# Altium project Super_Hornet_1.0.PrjPcb (part 3 of 5)
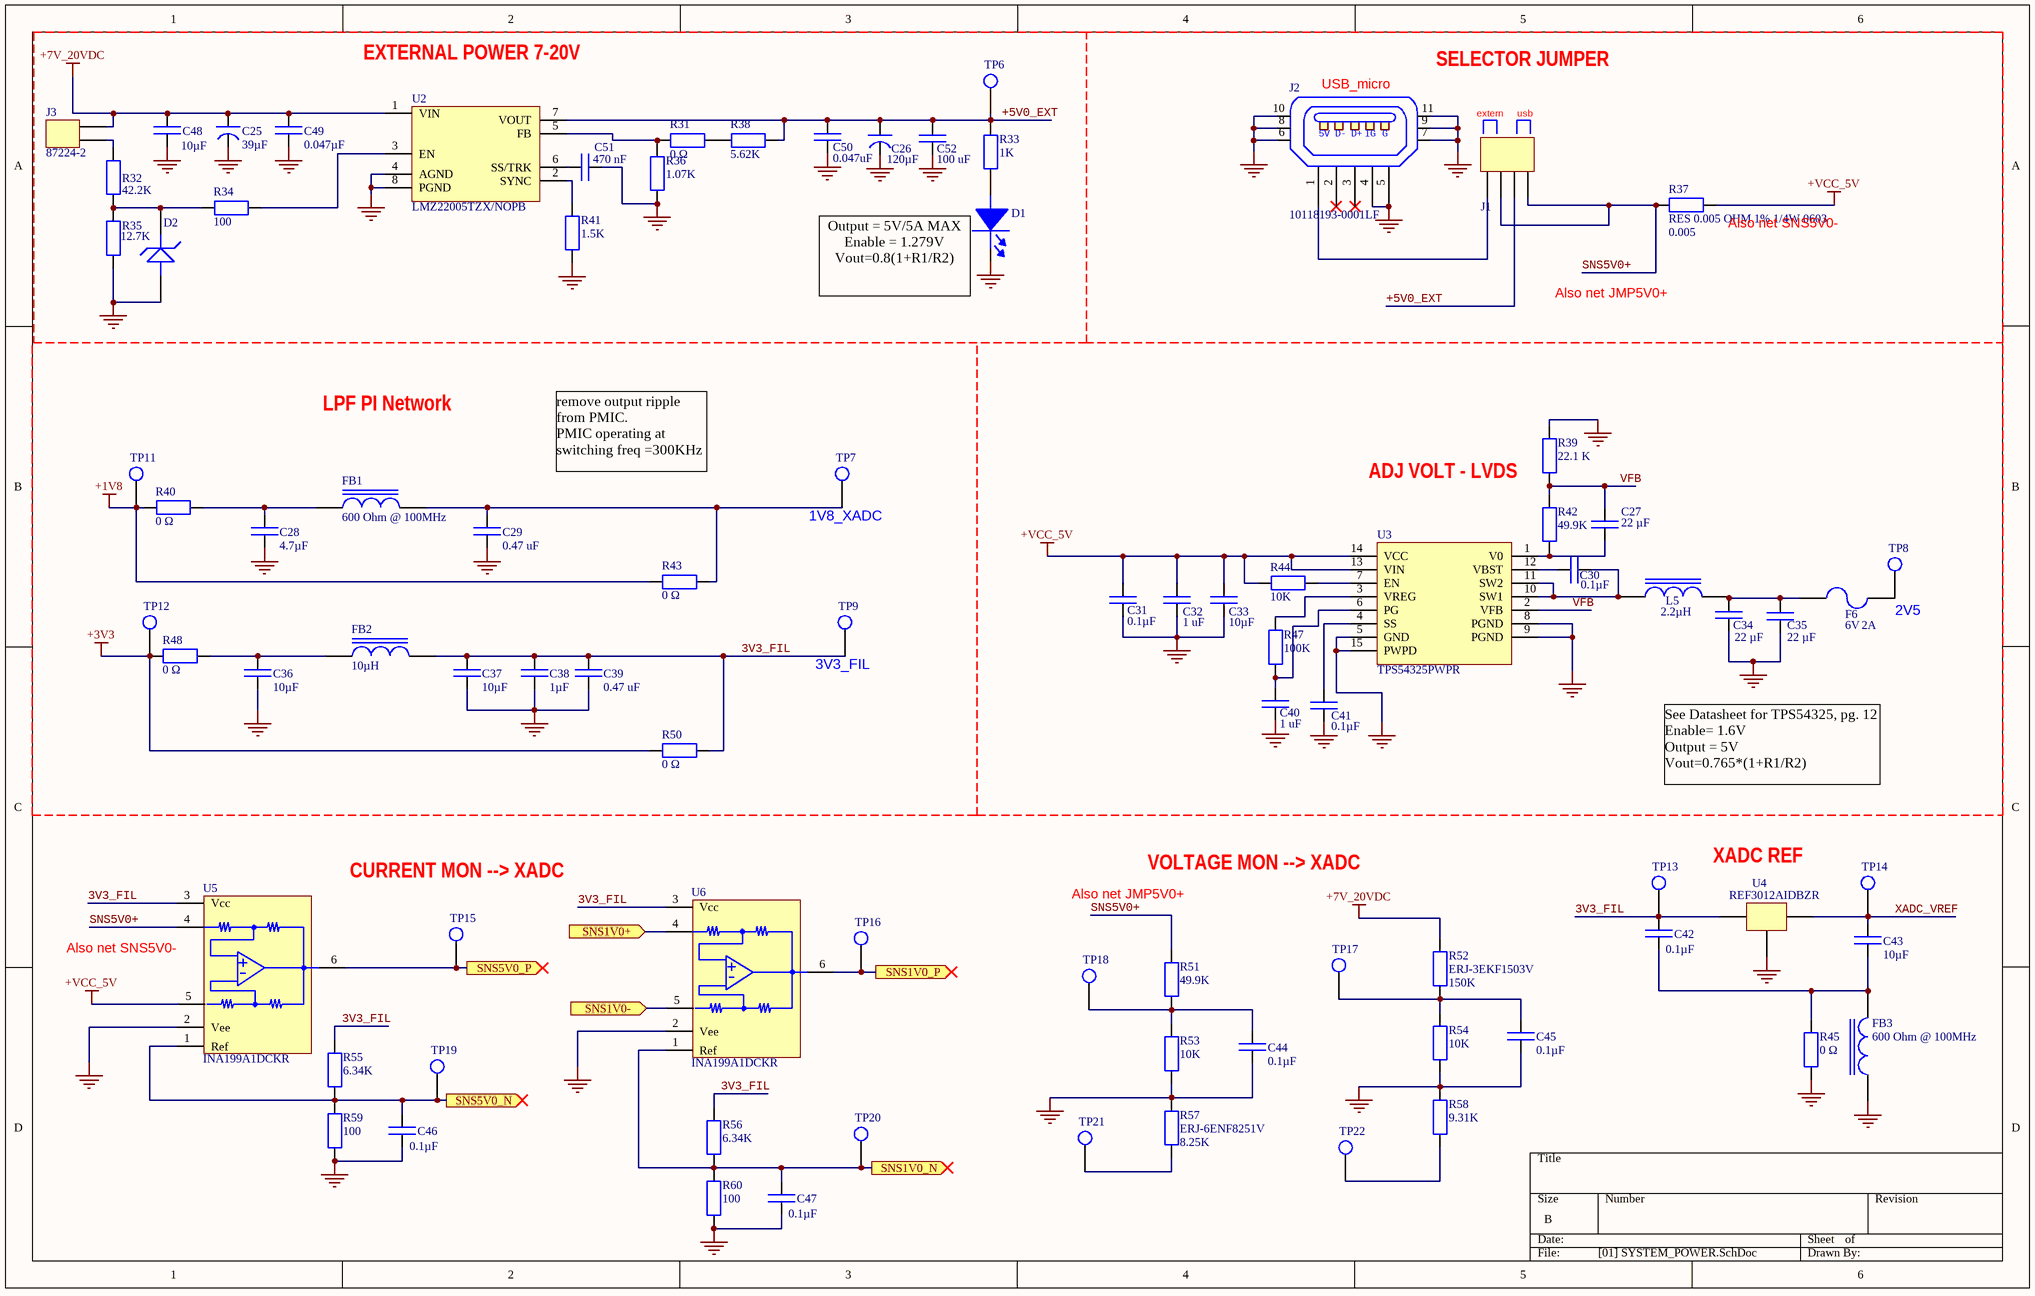
[diagram p4: [01] SYSTEM_POWER.SchDoc]

## Sheet [01] SYSTEM_POWER.SchDoc (continued)

### Library data of the parts (continued)
R35 = ERJ-3EKF1272V: RES SMD 12.7K OHM 1% 1/10W 0603; Manufacturer: Panasonic; Rated Power: 0.1 W; Temp Coefficient: ±100 ppm/°C; Supplier 1: Digi-Key; Manufacturer Part Number: ERJ-3EKF1272V; Stock 1: 278983; Pricing 1: 1=0.1, 10=0.032, 100=0.013, 1000=0.0058, 2500=0.0051 (USD); Size Code: 0603; Tolerance (%): ±1 %; ComponentLink1URL: http://www.farnell.com/datasheets/1678782.pdf?src-supplier=Element14; ComponentLink1Description: http://www.farnell.com/datasheets/1678782.pdf?src-supplier=Element14; ComponentLink2URL: http://www.farnell.com/datasheets/426256.pdf?src-supplier=Element14; ComponentLink2Description: http://www.farnell.com/datasheets/426256.pdf?src-supplier=Element14; ComponentLink3URL: http://www.alliedelec.com/m/d/623f45ff1957d936ff56d46fd1c28cac.pdf?src-supplier=Allied+Electronics; ComponentLink3Description: http://www.alliedelec.com/m/d/623f45ff1957d936ff56d46fd1c28cac.pdf?src-supplier=Allied+Electronics; ComponentLink4URL: http://industrial.panasonic.com/www-data/pdf/AOA0000/AOA0000CE2.pdf?src-supplier=Avnet; ComponentLink4Description: http://industrial.panasonic.com/www-data/pdf/AOA0000/AOA0000CE2.pdf?src-supplier=Avnet; Supplier Part Number 1: P12.7KHCT-ND
R36 = ERJ-6ENF1071V: RES SMD 1.07K OHM 1% 1/8W 0805; Manufacturer: Panasonic; EDA / CAD Models: Download from Accelerated Designs; Power (Watts): 0.125W, 1/8W; Temperature Coefficient: ±100ppm/°C; Online Catalog: ERJ Series; Kits: RSM3CA-ND  - RES KIT 1K-9.76K 1/8W 4800PCS RSM3C-ND  - RES KIT 1K-9.76K 1/8W 19200PCS; Other Names: ERJ-6ENF1071 ERJ6ENF1071 P1.07KCBK P1.07KCCT; Supplier 1: Digi-Key; Manufacturer Part Number: ERJ-6ENF1071V; Stock 1: 40812; Pricing 1: 1=0.1, 10=0.072, 100=0.0275, 1000=0.0121, 2500=0.0105 (USD); Standard Package: 1; Category: Resistors; Family: Chip Resistor - Surface Mount; Series: ERJ; Packaging: Cut Tape (CT); Tolerance: ±1%; Composition: Thick Film; Features: Automotive AEC-Q200; Operating Temperature: -55°C ~ 155°C; Package / Case: 0805 (2012 Metric); Supplier Device Package: 0805; Size / Dimension: 0.079" L x 0.049" W (2.00mm x 1.25mm); Height: 0.028" (0.70mm); Number of Terminations: 2; ComponentLink1URL: http://industrial.panasonic.com/www-data/pdf/AOA0000/AOA0000CE2.pdf?src-supplier=Avnet; ComponentLink1Description: http://industrial.panasonic.com/www-data/pdf/AOA0000/AOA0000CE2.pdf?src-supplier=Avnet; ComponentLink2URL: http://www.mouser.com/ds/2/315/AOA0000C283-1093288.pdf?src-supplier=Mouser; ComponentLink2Description: http://www.mouser.com/ds/2/315/AOA0000C283-1093288.pdf?src-supplier=Mouser; Supplier Part Number 1: P1.07KCCT-ND
R37 = ERJ-3LWFR005V: Manufacturer: Panasonic; Power (Watts): 0.25W, 1/4W; Temperature Coefficient: 0/ +700ppm/°C; Supplier 1: Digi-Key; Manufacturer Part Number: ERJ-3LWFR005V; Stock 1: 76322; Pricing 1: 1=0.51, 10=0.39, 25=0.2964, 50=0.2202, 100=0.1638, 250=0.1384, 500=0.1186, 1000=0.0904 (USD); Category: Resistors; Family: Chip Resistor - Surface Mount; Series: ERJ; Packaging: Tape & Reel (TR); Tolerance: ±1%; Composition: Thick Film; Features: Automotive AEC-Q200, Current Sense; Operating Temperature: -55°C ~ 125°C; Package / Case: 0603 (1608 Metric); Supplier Device Package: 0603; Size / Dimension: 0.063" L x 0.031" W (1.60mm x 0.80mm); Height: 0.026" (0.65mm); Number of Terminations: 2; ComponentLink1URL: http://www.mouser.com/ds/2/315/AOA0000C295-1109214.pdf?src-supplier=Mouser; ComponentLink1Description: http://www.mouser.com/ds/2/315/AOA0000C295-1109214.pdf?src-supplier=Mouser; ComponentLink2URL: https://industrial.panasonic.com/cdbs/www-data/pdf/RDN0000/AOA0000C313.pdf?src-supplier=Digi-Key; ComponentLink2Description: https://industrial.panasonic.com/cdbs/www-data/pdf/RDN0000/AOA0000C313.pdf?src-supplier=Digi-Key; ComponentLink3URL: http://www.farnell.com/datasheets/2631545.pdf?src-supplier=Farnell; ComponentLink3Description: http://www.farnell.com/datasheets/2631545.pdf?src-supplier=Farnell; ComponentLink4URL: http://www.farnell.com/datasheets/2631545.pdf?src-supplier=Newark; ComponentLink4Description: http://www.farnell.com/datasheets/2631545.pdf?src-supplier=Newark; Supplier Part Number 1: P19182CT-ND
R38 = ERJ-6ENF5621V: RES SMD 5.62K OHM 1% 1/8W 0805; Manufacturer: Panasonic; Resistor Element Type: Thick Film; Product Range: PANASONIC - ERJ Series; Power Rating: 125mW; Resistor Case Style: 0805 [2012 Metric]; Temperature Coefficient: ± 100ppm/°C; Voltage Rating: 150V; SVHC: Diboron trioxide (19-Dec-2012); SVHC (Secondary): Lead monoxide (lead oxide) (19-Dec-2012); Supplier 1: Digi-Key; Manufacturer Part Number: ERJ-6ENF5621V; Stock 1: 24844; Pricing 1: 1=0.1, 10=0.072, 100=0.0275, 1000=0.0121, 2500=0.0105 (USD); Resistance Tolerance: ± 1%; Resistor Element Material: Thick Film; Packaging: Cut Tape; MSL: (Not Applicable); Resistor Mounting: SMD; ComponentLink1URL: http://industrial.panasonic.com/www-data/pdf/AOA0000/AOA0000CE2.pdf?src-supplier=Avnet; ComponentLink1Description: http://industrial.panasonic.com/www-data/pdf/AOA0000/AOA0000CE2.pdf?src-supplier=Avnet; ComponentLink2URL: http://www.farnell.com/datasheets/426256.pdf?src-supplier=Element14; ComponentLink2Description: http://www.farnell.com/datasheets/426256.pdf?src-supplier=Element14; ComponentLink3URL: http://www.farnell.com/datasheets/1911175.pdf?src-supplier=Farnell; ComponentLink3Description: http://www.farnell.com/datasheets/1911175.pdf?src-supplier=Farnell; ComponentLink4URL: http://industrial.panasonic.com/www-data/pdf/AOA0000/AOA0000CE2.pdf?src-supplier=Avnet+Europe; ComponentLink4Description: http://industrial.panasonic.com/www-data/pdf/AOA0000/AOA0000CE2.pdf?src-supplier=Avnet+Europe; ComponentLink5URL: http://www.farnell.com/datasheets/1678782.pdf?src-supplier=Element14; ComponentLink5Description: http://www.farnell.com/datasheets/1678782.pdf?src-supplier=Element14; Supplier Part Number 1: P5.62KCCT-ND
R39 = ERJ-3EKF2212V: RES SMD 22.1K OHM 1% 1/10W 0603; Manufacturer: Panasonic; Rated Power: 0.1 W; Temp Coefficient: ±100 ppm/°C; Supplier 1: Digi-Key; Manufacturer Part Number: ERJ-3EKF2212V; Stock 1: 927679; Pricing 1: 1=0.1, 10=0.064, 100=0.0258, 1000=0.0116, 2500=0.0101 (USD); Size Code: 0603; Tolerance (%): ±1 %; ComponentLink1URL: http://industrial.panasonic.com/cdbs/www-data/pdf/RDA0000/AOA0000C304.pdf?src-supplier=Farnell; ComponentLink1Description: http://industrial.panasonic.com/cdbs/www-data/pdf/RDA0000/AOA0000C304.pdf?src-supplier=Farnell; ComponentLink2URL: http://www.mouser.com/ds/2/315/AOA0000C283-1093288.pdf?src-supplier=Mouser; ComponentLink2Description: http://www.mouser.com/ds/2/315/AOA0000C283-1093288.pdf?src-supplier=Mouser; ComponentLink3URL: http://www.farnell.com/datasheets/1678782.pdf?src-supplier=Element14; ComponentLink3Description: http://www.farnell.com/datasheets/1678782.pdf?src-supplier=Element14; ComponentLink4URL: http://industrial.panasonic.com/www-data/pdf/AOA0000/AOA0000CE2.pdf?src-supplier=Future+Electronics; ComponentLink4Description: http://industrial.panasonic.com/www-data/pdf/AOA0000/AOA0000CE2.pdf?src-supplier=Future+Electronics; ComponentLink5URL: http://industrial.panasonic.com/www-data/pdf/AOA0000/AOA0000CE2.pdf?src-supplier=Avnet+Europe; ComponentLink5Description: http://industrial.panasonic.com/www-data/pdf/AOA0000/AOA0000CE2.pdf?src-supplier=Avnet+Europe; ComponentLink6URL: http://industrial.panasonic.com/www-data/pdf/AOA0000/AOA0000CE2.pdf?src-supplier=Avnet; ComponentLink6Description: http://industrial.panasonic.com/www-data/pdf/AOA0000/AOA0000CE2.pdf?src-supplier=Avnet; ComponentLink7URL: https://www.alliedelec.com/m/d/623f45ff1957d936ff56d46fd1c28cac.pdf?src-supplier=Allied+Electronics; ComponentLink7Description: https://www.alliedelec.com/m/d/623f45ff1957d936ff56d46fd1c28cac.pdf?src-supplier=Allied+Electronics; ComponentLink8URL: http://www.jameco.com/Jameco/Products/ProdDS/1987775.pdf?src-supplier=Jameco; ComponentLink8Description: http://www.jameco.com/Jameco/Products/ProdDS/1987775.pdf?src-supplier=Jameco; ComponentLink9URL: http://industrial.panasonic.com/cdbs/www-data/pdf/RDA0000/AOA0000C304.pdf?src-supplier=Element14; ComponentLink9Description: http://industrial.panasonic.com/cdbs/www-data/pdf/RDA0000/AOA0000C304.pdf?src-supplier=Element14; Supplier Part Number 1: P22.1KHCT-ND
R41 = ERJ-3EKF1501V: RES SMD 1.5K OHM ±1% 1/10W 0603; Manufacturer: Panasonic; Power Rating: 100 mW; Temperature Coefficient: 100 PPM / C; Voltage Rating: 75 V; Qualification: AEC-Q200; Unit Weight: 0.000071 oz; Supplier 1: Digi-Key; Manufacturer Part Number: ERJ-3EKF1501V; Stock 1: 1002673; Pricing 1: 1=0.1, 10=0.066, 100=0.027, 1000=0.0121, 2500=0.0105 (USD); Product Category: Thick Film Resistors; RoHS: True; Tolerance: 1 %; Case Code - in: 0603; Case Code - mm: 1608; Operating Temperature Range: - 55 C to + 155 C; Series: ERJ; Type: Precision Thick Film Resistors SMD; Brand: Panasonic; Features: High reliability, Small Size and Light Weight; Height: 0.45 mm; Length: 1.6 mm; Package / Case: 0603 (1608 metric); Packaging: Reel; Product: Thick Film Resistors SMD; Factory Pack Quantity: 5000; Termination Style: SMD/SMT; Width: 0.8 mm; ComponentLink1URL: http://www.farnell.com/datasheets/426256.pdf?src-supplier=Element14; ComponentLink1Description: http://www.farnell.com/datasheets/426256.pdf?src-supplier=Element14; ComponentLink2URL: http://industrial.panasonic.com/www-data/pdf/AOA0000/AOA0000CE2.pdf?src-supplier=Avnet; ComponentLink2Description: http://industrial.panasonic.com/www-data/pdf/AOA0000/AOA0000CE2.pdf?src-supplier=Avnet; ComponentLink3URL: http://www.jameco.com/Jameco/Products/ProdDS/1987644.pdf?src-supplier=Jameco; ComponentLink3Description: http://www.jameco.com/Jameco/Products/ProdDS/1987644.pdf?src-supplier=Jameco; ComponentLink4URL: https://industrial.panasonic.com/cdbs/www-data/pdf/RDA0000/DMA0000COL11.pdf?src-supplier=Avnet+Asia; ComponentLink4Description: https://industrial.panasonic.com/cdbs/www-data/pdf/RDA0000/DMA0000COL11.pdf?src-supplier=Avnet+Asia; ComponentLink5URL: http://industrial.panasonic.com/www-data/pdf/AOA0000/AOA0000CE2.pdf?src-supplier=Avnet+Europe; ComponentLink5Description: http://industrial.panasonic.com/www-data/pdf/AOA0000/AOA0000CE2.pdf?src-supplier=Avnet+Europe; ComponentLink6URL: http://www.farnell.com/datasheets/1678782.pdf?src-supplier=Element14; ComponentLink6Description: http://www.farnell.com/datasheets/1678782.pdf?src-supplier=Element14; ComponentLink7URL: http://industrial.panasonic.com/www-data/pdf/AOA0000/AOA0000CE2.pdf?src-supplier=Element14; ComponentLink7Description: http://industrial.panasonic.com/www-data/pdf/AOA0000/AOA0000CE2.pdf?src-supplier=Element14; ComponentLink8URL: http://industrial.panasonic.com/www-data/pdf/AOA0000/AOA0000CE2.pdf?src-supplier=Future+Electronics; ComponentLink8Description: http://industrial.panasonic.com/www-data/pdf/AOA0000/AOA0000CE2.pdf?src-supplier=Future+Electronics; ComponentLink9URL: http://www.alliedelec.com/m/d/623f45ff1957d936ff56d46fd1c28cac.pdf?src-supplier=Allied+Electronics; ComponentLink9Description: http://www.alliedelec.com/m/d/623f45ff1957d936ff56d46fd1c28cac.pdf?src-supplier=Allied+Electronics; ComponentLink10URL: http://industrial.panasonic.com/cdbs/www-data/pdf/RDA0000/AOA0000COL19.pdf?src-supplier=Mouser; ComponentLink10Description: http://industrial.panasonic.com/cdbs/www-data/pdf/RDA0000/AOA0000COL19.pdf?src-supplier=Mouser; Supplier Part Number 1: P1.50KHCT-ND
R42 R51 = ERJ-3EKF4992V: RES SMD 49.9K OHM 1% 1/10W 0603; Manufacturer: Panasonic; Rated Power: 0.1 W; Temp Coefficient: ±100 ppm/°C; Supplier 1: Digi-Key; Stock 1: 110527; Pricing 1: 1=0.1, 10=0.035, 100=0.0143, 1000=0.0064, 2500=0.0056 (USD); Size Code: 0603; Tolerance (%): ±1 %; ComponentLink1URL: http://industrial.panasonic.com/cdbs/www-data/pdf/RDA0000/AOA0000C304.pdf?src-supplier=Farnell; ComponentLink1Description: http://industrial.panasonic.com/cdbs/www-data/pdf/RDA0000/AOA0000C304.pdf?src-supplier=Farnell; ComponentLink2URL: http://www.farnell.com/datasheets/1911175.pdf?src-supplier=Element14; ComponentLink2Description: http://www.farnell.com/datasheets/1911175.pdf?src-supplier=Element14; ComponentLink3URL: http://industrial.panasonic.com/www-data/pdf/AOA0000/AOA0000CE2.pdf?src-supplier=Future+Electronics; ComponentLink3Description: http://industrial.panasonic.com/www-data/pdf/AOA0000/AOA0000CE2.pdf?src-supplier=Future+Electronics; ComponentLink4URL: http://industrial.panasonic.com/www-data/pdf/AOA0000/AOA0000CE2.pdf?src-supplier=Avnet+Europe; ComponentLink4Description: http://industrial.panasonic.com/www-data/pdf/AOA0000/AOA0000CE2.pdf?src-supplier=Avnet+Europe; ComponentLink5URL: http://www.farnell.com/datasheets/1911175.pdf?src-supplier=Farnell; ComponentLink5Description: http://www.farnell.com/datasheets/1911175.pdf?src-supplier=Farnell; ComponentLink6URL: http://industrial.panasonic.com/www-data/pdf/AOA0000/AOA0000CE2.pdf?src-supplier=Avnet; ComponentLink6Description: http://industrial.panasonic.com/www-data/pdf/AOA0000/AOA0000CE2.pdf?src-supplier=Avnet; ComponentLink7URL: http://www.farnell.com/datasheets/1678782.pdf?src-supplier=Element14; ComponentLink7Description: http://www.farnell.com/datasheets/1678782.pdf?src-supplier=Element14; ComponentLink8URL: https://www.verical.com/server-webapp/html/getDatasheet?partID=52039&src-supplier=Verical; ComponentLink8Description: https://www.verical.com/server-webapp/html/getDatasheet?partID=52039&src-supplier=Verical; ComponentLink9URL: http://www.jameco.com/Jameco/Products/ProdDS/1988209.pdf?src-supplier=Jameco; ComponentLink9Description: http://www.jameco.com/Jameco/Products/ProdDS/1988209.pdf?src-supplier=Jameco; Supplier Part Number 1: P49.9KHCT-ND; Manufacturer Part Number: ERJ-3EKF4992V
R44 R53 R54 = ERJ-3EKF1002V: RES SMD 10K OHM 1% 1/10W 0603; Manufacturer: Panasonic; Rated Power: 0.1 W; Temp Coefficient: 100 ppm/C; Supplier 1: Digi-Key; Manufacturer Part Number: ERJ-3EKF1002V; Stock 1: 2668173; Pricing 1: 1=0.1, 10=0.06, 100=0.0244, 1000=0.0109, 2500=0.0095 (USD); Size Code: 0603; Tolerance (%): 1 %; ComponentLink1URL: https://industrial.panasonic.com/cdbs/www-data/pdf/RDA0000/DMA0000COL11.pdf?src-supplier=Avnet+Asia; ComponentLink1Description: https://industrial.panasonic.com/cdbs/www-data/pdf/RDA0000/DMA0000COL11.pdf?src-supplier=Avnet+Asia; ComponentLink2URL: http://www.farnell.com/datasheets/1911175.pdf?src-supplier=Element14; ComponentLink2Description: http://www.farnell.com/datasheets/1911175.pdf?src-supplier=Element14; ComponentLink3URL: https://industrial.panasonic.com/cdbs/www-data/pdf/RDA0000/DMA0000COL11.pdf?src-supplier=Avnet; ComponentLink3Description: https://industrial.panasonic.com/cdbs/www-data/pdf/RDA0000/DMA0000COL11.pdf?src-supplier=Avnet; ComponentLink4URL: http://industrial.panasonic.com/www-data/pdf/AOA0000/AOA0000CE2.pdf?src-supplier=Avnet+Europe; ComponentLink4Description: http://industrial.panasonic.com/www-data/pdf/AOA0000/AOA0000CE2.pdf?src-supplier=Avnet+Europe; ComponentLink5URL: http://industrial.panasonic.com/www-data/pdf/AOA0000/AOA0000CE2.pdf?src-supplier=Avnet; ComponentLink5Description: http://industrial.panasonic.com/www-data/pdf/AOA0000/AOA0000CE2.pdf?src-supplier=Avnet; ComponentLink6URL: https://industrial.panasonic.com/cdbs/www-data/pdf/RDA0000/DMA0000COL11.pdf?src-supplier=Mouser; ComponentLink6Description: https://industrial.panasonic.com/cdbs/www-data/pdf/RDA0000/DMA0000COL11.pdf?src-supplier=Mouser; ComponentLink7URL: https://industrial.panasonic.com/cdbs/www-data/pdf/RDA0000/DMA0000COL11.pdf?src-supplier=Allied+Electronics; ComponentLink7Description: https://industrial.panasonic.com/cdbs/www-data/pdf/RDA0000/DMA0000COL11.pdf?src-supplier=Allied+Electronics; Supplier Part Number 1: P10.0KHDKR-ND
R47 = ERJ3EKF1003V: RES SMD 100K OHM 1% 1/10W 0603; Manufacturer: Panasonic; Rated Power: 0.1 W; Temp Coefficient: ±100 ppm/°C; Supplier 1: Digi-Key; Manufacturer Part Number: ERJ3EKF1003V; Stock 1: 221575; Pricing 1: 1=0.1, 10=0.062, 100=0.0252, 1000=0.0113, 2500=0.0098 (USD); Size Code: 0603; Tolerance (%): ±1 %; ComponentLink1URL: http://industrial.panasonic.com/www-data/pdf/AOA0000/AOA0000CE2.pdf?src-supplier=Future+Electronics; ComponentLink1Description: http://industrial.panasonic.com/www-data/pdf/AOA0000/AOA0000CE2.pdf?src-supplier=Future+Electronics; ComponentLink2URL: https://www.verical.com/server-webapp/html/getDatasheet?partID=247527&src-supplier=Verical; ComponentLink2Description: https://www.verical.com/server-webapp/html/getDatasheet?partID=247527&src-supplier=Verical; ComponentLink3URL: http://www.alliedelec.com/m/d/623f45ff1957d936ff56d46fd1c28cac.pdf?src-supplier=Allied+Electronics; ComponentLink3Description: http://www.alliedelec.com/m/d/623f45ff1957d936ff56d46fd1c28cac.pdf?src-supplier=Allied+Electronics; ComponentLink4URL: http://www.jameco.com/Jameco/Products/ProdDS/1987476.pdf?src-supplier=Jameco; ComponentLink4Description: http://www.jameco.com/Jameco/Products/ProdDS/1987476.pdf?src-supplier=Jameco; Supplier Part Number 1: P100KHCT-ND
R52 = ERJ-3EKF1503V: RES SMD 150K OHM 1% 1/10W 0603; Manufacturer: Panasonic; Case Style: Molded; Temperature Coefficient: ±100 ppm/°C; Lead Finish: Tin; Supplier 1: Digi-Key; Manufacturer Part Number: ERJ-3EKF1503V; Stock 1: 81478; Pricing 1: 1=0.1, 10=0.058, 100=0.0234, 1000=0.0105, 2500=0.0091 (USD); Case Size: 0603; Type: Thick Film; Tolerance: 1 %; Power Rating: 1/10 W; Operating Temperature: -55 to 155 °C; Category: Resistor Fixed Single-Surface Mount; ComponentLink1URL: http://industrial.panasonic.com/www-data/pdf/AOA0000/AOA0000CE2.pdf?src-supplier=Avnet+Europe; ComponentLink1Description: http://industrial.panasonic.com/www-data/pdf/AOA0000/AOA0000CE2.pdf?src-supplier=Avnet+Europe; ComponentLink2URL: http://industrial.panasonic.com/www-data/pdf/AOA0000/AOA0000CE2.pdf?src-supplier=Avnet; ComponentLink2Description: http://industrial.panasonic.com/www-data/pdf/AOA0000/AOA0000CE2.pdf?src-supplier=Avnet; ComponentLink3URL: http://www.alliedelec.com/m/d/623f45ff1957d936ff56d46fd1c28cac.pdf?src-supplier=Allied+Electronics; ComponentLink3Description: http://www.alliedelec.com/m/d/623f45ff1957d936ff56d46fd1c28cac.pdf?src-supplier=Allied+Electronics; ComponentLink4URL: http://industrial.panasonic.com/www-data/pdf/AOA0000/AOA0000CE2.pdf?src-supplier=Element14; ComponentLink4Description: http://industrial.panasonic.com/www-data/pdf/AOA0000/AOA0000CE2.pdf?src-supplier=Element14; ComponentLink5URL: http://www.farnell.com/datasheets/426256.pdf?src-supplier=Element14; ComponentLink5Description: http://www.farnell.com/datasheets/426256.pdf?src-supplier=Element14; ComponentLink6URL: http://www.farnell.com/datasheets/1678782.pdf?src-supplier=Element14; ComponentLink6Description: http://www.farnell.com/datasheets/1678782.pdf?src-supplier=Element14; ComponentLink7URL: http://www.farnell.com/datasheets/1911175.pdf?src-supplier=Farnell; ComponentLink7Description: http://www.farnell.com/datasheets/1911175.pdf?src-supplier=Farnell; Supplier Part Number 1: P150KHCT-ND
R55 R56 = ERJ-3EKF6341V: RES SMD 6.34K OHM 1% 1/10W 0603; Manufacturer: Panasonic; Resistor Element Type: Thick Film; Product Range: PANASONIC - ERJ Series; Power Rating: 100mW; Resistor Case Style: 0603 [1608 Metric]; Temperature Coefficient: ± 100ppm/°C; Voltage Rating: 75V; SVHC: Diboron trioxide (19-Dec-2012); SVHC (Secondary): Lead monoxide (lead oxide) (19-Dec-2012); Supplier 1: Digi-Key; Manufacturer Part Number: ERJ-3EKF6341V; Stock 1: 215692; Pricing 1: 1=0.1, 10=0.05, 100=0.0203, 1000=0.0091, 2500=0.0079 (USD); Resistance Tolerance: ± 1%; Resistor Element Material: Thick Film; Packaging: Cut Tape; MSL: (Not Applicable); Resistor Mounting: SMD; ComponentLink1URL: http://www.farnell.com/datasheets/426256.pdf?src-supplier=Element14; ComponentLink1Description: http://www.farnell.com/datasheets/426256.pdf?src-supplier=Element14; ComponentLink2URL: http://www.mouser.com/ds/2/315/AOA0000C283-1093288.pdf?src-supplier=Mouser; ComponentLink2Description: http://www.mouser.com/ds/2/315/AOA0000C283-1093288.pdf?src-supplier=Mouser; ComponentLink3URL: https://www.alliedelec.com/m/d/623f45ff1957d936ff56d46fd1c28cac.pdf?src-supplier=Allied+Electronics; ComponentLink3Description: https://www.alliedelec.com/m/d/623f45ff1957d936ff56d46fd1c28cac.pdf?src-supplier=Allied+Electronics; ComponentLink4URL: http://www.farnell.com/datasheets/1911175.pdf?src-supplier=Farnell; ComponentLink4Description: http://www.farnell.com/datasheets/1911175.pdf?src-supplier=Farnell; ComponentLink5URL: http://www.farnell.com/datasheets/1678782.pdf?src-supplier=Element14; ComponentLink5Description: http://www.farnell.com/datasheets/1678782.pdf?src-supplier=Element14; ComponentLink6URL: http://industrial.panasonic.com/www-data/pdf/AOA0000/AOA0000CE2.pdf?src-supplier=Avnet; ComponentLink6Description: http://industrial.panasonic.com/www-data/pdf/AOA0000/AOA0000CE2.pdf?src-supplier=Avnet; Supplier Part Number 1: P6.34KHCT-ND
R57 = ERJ-6ENF8251V: RES SMD 8.25K OHM 1% 1/8W 0805; Manufacturer: Panasonic; Resistor Element Type: Thick Film; Temperature Coefficient: ± 100ppm/°C; Voltage Rating: 150V; SVHC: To Be Advised; Product Range: PANASONIC - ERJ Series Thick Film Chip Resistors; Power Rating: 125mW; Resistor Case Style: 0805 ^2012 Metric]; Supplier 1: Digi-Key; Manufacturer Part Number: ERJ-6ENF8251V; Stock 1: 31520; Pricing 1: 1=0.1, 10=0.072, 100=0.0275, 1000=0.0121, 2500=0.0105 (USD); Packaging: Full Reel; Resistance Tolerance: ± 1%; ComponentLink1URL: http://industrial.panasonic.com/www-data/pdf/AOA0000/AOA0000CE2.pdf?src-supplier=Avnet+Europe; ComponentLink1Description: http://industrial.panasonic.com/www-data/pdf/AOA0000/AOA0000CE2.pdf?src-supplier=Avnet+Europe; ComponentLink2URL: http://www.jameco.com/Jameco/Products/ProdDS/1989586.pdf?src-supplier=Jameco; ComponentLink2Description: http://www.jameco.com/Jameco/Products/ProdDS/1989586.pdf?src-supplier=Jameco; ComponentLink3URL: http://www.farnell.com/datasheets/426256.pdf?src-supplier=Element14; ComponentLink3Description: http://www.farnell.com/datasheets/426256.pdf?src-supplier=Element14; ComponentLink4URL: https://www.verical.com/server-webapp/html/getDatasheet?partID=29070&src-supplier=Verical; ComponentLink4Description: https://www.verical.com/server-webapp/html/getDatasheet?partID=29070&src-supplier=Verical; ComponentLink5URL: http://www.farnell.com/datasheets/1678782.pdf?src-supplier=Element14; ComponentLink5Description: http://www.farnell.com/datasheets/1678782.pdf?src-supplier=Element14; ComponentLink6URL: http://www.farnell.com/datasheets/1911175.pdf?src-supplier=Farnell; ComponentLink6Description: http://www.farnell.com/datasheets/1911175.pdf?src-supplier=Farnell; ComponentLink7URL: http://industrial.panasonic.com/cdbs/www-data/pdf/RDA0000/AOA0000C304.pdf?src-supplier=Farnell; ComponentLink7Description: http://industrial.panasonic.com/cdbs/www-data/pdf/RDA0000/AOA0000C304.pdf?src-supplier=Farnell; Supplier Part Number 1: P8.25KCCT-ND
R58 = ERJ-3EKF9311V: RES SMD 9.31K OHM 1% 1/10W 0603; Manufacturer: Panasonic; Rated Power: 0.1 W; Temp Coefficient: ±100 ppm/°C; Supplier 1: Digi-Key; Manufacturer Part Number: ERJ-3EKF9311V; Stock 1: 98740; Pricing 1: 1=0.1, 10=0.062, 100=0.0253, 1000=0.0113, 2500=0.0098 (USD); Size Code: 0603; Tolerance (%): ±1 %; ComponentLink1URL: http://industrial.panasonic.com/www-data/pdf/AOA0000/AOA0000CE2.pdf?src-supplier=Avnet; ComponentLink1Description: http://industrial.panasonic.com/www-data/pdf/AOA0000/AOA0000CE2.pdf?src-supplier=Avnet; ComponentLink2URL: http://www.farnell.com/datasheets/1678782.pdf?src-supplier=Element14; ComponentLink2Description: http://www.farnell.com/datasheets/1678782.pdf?src-supplier=Element14; ComponentLink3URL: http://industrial.panasonic.com/www-data/pdf/AOA0000/AOA0000CE2.pdf?src-supplier=Future+Electronics; ComponentLink3Description: http://industrial.panasonic.com/www-data/pdf/AOA0000/AOA0000CE2.pdf?src-supplier=Future+Electronics; ComponentLink4URL: http://industrial.panasonic.com/www-data/pdf/AOA0000/AOA0000CE2.pdf?src-supplier=Avnet+Asia; ComponentLink4Description: http://industrial.panasonic.com/www-data/pdf/AOA0000/AOA0000CE2.pdf?src-supplier=Avnet+Asia; ComponentLink5URL: http://www.farnell.com/datasheets/1911175.pdf?src-supplier=Farnell; ComponentLink5Description: http://www.farnell.com/datasheets/1911175.pdf?src-supplier=Farnell; ComponentLink6URL: https://www.alliedelec.com/m/d/623f45ff1957d936ff56d46fd1c28cac.pdf?src-supplier=Allied+Electronics; ComponentLink6Description: https://www.alliedelec.com/m/d/623f45ff1957d936ff56d46fd1c28cac.pdf?src-supplier=Allied+Electronics; ComponentLink7URL: http://industrial.panasonic.com/www-data/pdf/AOA0000/AOA0000CE2.pdf?src-supplier=Avnet+Europe; ComponentLink7Description: http://industrial.panasonic.com/www-data/pdf/AOA0000/AOA0000CE2.pdf?src-supplier=Avnet+Europe; ComponentLink8URL: http://www.mouser.com/ds/2/315/AOA0000CE2-37512.pdf?src-supplier=Mouser; ComponentLink8Description: http://www.mouser.com/ds/2/315/AOA0000CE2-37512.pdf?src-supplier=Mouser; ComponentLink9URL: http://www.farnell.com/datasheets/1911175.pdf?src-supplier=Element14; ComponentLink9Description: http://www.farnell.com/datasheets/1911175.pdf?src-supplier=Element14; Supplier Part Number 1: P9.31KHCT-ND
TP6-TP9 TP11-TP22 = 5017: PCB MINI TEST POINT; Manufacturer: Keystone Electronics; Minimum Quantity: PC Test Point, Miniature; Dynamic Catalog: Surface Mount Test Points; Featured Product: 5019 Miniature Surface Mount Test Point; Other Names: 5017-ND / 5017KTR / Q5021014; Supplier 1: Digi-Key; Manufacturer Part Number: 5017; Stock 1: 285000; Pricing 1: 5000=0.0924 (USD); Quantity Available: Tape & Reel (TR)Alternate Packaging; RoHS Information: RoHS Compliance Statement; Standard Package: 5,000; Category: Test and Measurement; Family: Test Points; Packaging: Tape & Reel (TR); Type: PC Test Point, Miniature; Terminal: 0.010" (0.25mm) Phosphor Bronze, Silver Plated; Mounting Type: Surface Mount; Material: Phosphor Bronze; Online Catalog: Surface Mount Test Points; ComponentLink1URL: http://www.keyelco.com/product-pdf.cfm?p=1355&src-supplier=Digi-Key; ComponentLink1Description: http://www.keyelco.com/product-pdf.cfm?p=1355&src-supplier=Digi-Key; Supplier Part Number 1: 36-5017TR-NDL
U2 = LMZ22005TZX/NOPB: DC DC CONVERTER 0.8-6V; Manufacturer: TI National Semiconductor; Output Power: 30W; Number of Outputs: 1; Output Current: 5A; Screening Level: Automotive; Product Length (mm): 10.16mm; Product Height (mm): 4.57mm; Product Depth (mm): Surface Mount; Supplier 1: Digi-Key; Stock 1: 1814; Pricing 1: 1=9.19, 5=9.124, 10=9.055, 25=8.9156, 50=8.637, 100=7.8012, 250=7.6619 (USD); Mounting Style: Surface Mount; Packaging: Tape and Reel; Operating Temperature (Min): -40C; Type: Step Down; Pin Count: Tape and Reel; Package / Case: -40C; Operating Temperature (Max): 125C; ComponentLink1URL: http://www.ti.com/lit/ds/symlink/lmz22005.pdf?src-supplier=Digi-Key; ComponentLink1Description: http://www.ti.com/lit/ds/symlink/lmz22005.pdf?src-supplier=Digi-Key; Supplier Part Number 1: 296-43603-1-ND; Manufacturer Part Number: LMZ22005TZX/NOPB
U3 = TPS54325PWPR: IC REG BUCK ADJ 3A SYNC 14HTSSOP; Manufacturer: Texas Instruments; Product Training Modules: Understanding SWIFT Step Down Dc/Dc Converters; Featured Product: TPS54325 - 3A Step-Down SWIFT™ Converter / WEBENCH Design Center; Output Type: Adjustable; Number of Outputs: 1; Voltage - Output: 0.76 V ~ 5.5 V; Voltage - Input: 2 V ~ 18 V; PWM Type: Hybrid; Frequency - Switching: 700kHz; Synchronous Rectifier: Yes; Dynamic Catalog: Buck (Step-Down) IC; Other Names: 296-24557-1; Supplier 1: Digi-Key; Manufacturer Part Number: TPS54325PWPR; Stock 1: 45243; Pricing 1: 1=1.63, 10=1.468, 25=1.3852, 100=1.108, 250=0.9695, 500=0.9418, 1000=0.7479 (USD); Standard Package: 1; Category: Integrated Circuits (ICs); Family: PMIC - Voltage Regulators - DC DC Switching Regulators; Series: SWIFT™, D-CAP2™; Type: Step-Down (Buck); Current - Output: 3A; Operating Temperature: -40°C ~ 85°C; Mounting Type: Surface Mount; Package / Case: 14-TSSOP (0.173", 4.40mm Width) Exposed Pad; Packaging: Cut Tape (CT); Supplier Device Package: 14-HTSSOP; ComponentLink1URL: http://www.ti.com/lit/ds/symlink/tps54325.pdf?src-supplier=Digi-Key; ComponentLink1Description: http://www.ti.com/lit/ds/symlink/tps54325.pdf?src-supplier=Digi-Key; ComponentLink2URL: http://www.ti.com/lit/gpn/tps54325?src-supplier=Mouser; ComponentLink2Description: http://www.ti.com/lit/gpn/tps54325?src-supplier=Mouser; ComponentLink3URL: http://www.ti.com/general/docs/lit/getliterature.tsp?genericPartNumber=TPS54325&&fileType=pdf&src-supplier=Avnet; ComponentLink3Description: http://www.ti.com/general/docs/lit/getliterature.tsp?genericPartNumber=TPS54325&&fileType=pdf&src-supplier=Avnet; ComponentLink4URL: http://datasheet.iiic.cc/texas_instruments/TPS54325PWPR.pdf?src-supplier=IIIC; ComponentLink4Description: http://datasheet.iiic.cc/texas_instruments/TPS54325PWPR.pdf?src-supplier=IIIC; ComponentLink5URL: http://www.produktinfo.conrad.com/datenblaetter/1000000-1099999/001014848-da-01-en-IC_REG_BUCK_SY_TPS54325PWPR_TSSOP_14_TID.pdf?src-supplier=Conrad; ComponentLink5Description: http://www.produktinfo.conrad.com/datenblaetter/1000000-1099999/001014848-da-01-en-IC_REG_BUCK_SY_TPS54325PWPR_TSSOP_14_TID.pdf?src-supplier=Conrad; Supplier Part Number 1: 296-24557-1-ND
U4 = REF3012AIDBZR: IC VREF SERIES 0.2% SOT23-3; Manufacturer: Texas Instruments; Reference Type: Precision; Output Voltage: 1.25 V; Maximum Input Voltage: 7 V; Maximum Temperature Coefficient: 75 ppm/°C; Line Regulation: 190 uV/V; Load Regulation: 100 uV/mA; Maximum Output Current: 25 mA; Rad Hard: No; Supplier 1: Digi-Key; Stock 1: 28859; Pricing 1: 1=1.39, 10=1.245, 25=1.1816, 100=0.9073, 250=0.8018, 500=0.7596, 1000=0.5908 (USD); Package: 3SOT-23; Packaging: Tape & Reel; Topology: Series; Initial Accuracy: 0.2 %; Operating Temperature: -40 to 125 °C; Mounting: Surface Mount; Category: Voltage Reference; ComponentLink1URL: http://www.ti.com/lit/ds/symlink/ref3012.pdf?src-supplier=Digi-Key; ComponentLink1Description: http://www.ti.com/lit/ds/symlink/ref3012.pdf?src-supplier=Digi-Key; ComponentLink2URL: http://www.ti.com/general/docs/lit/getliterature.tsp?genericPartNumber=REF3030&&fileType=pdf&src-supplier=Avnet; ComponentLink2Description: http://www.ti.com/general/docs/lit/getliterature.tsp?genericPartNumber=REF3030&&fileType=pdf&src-supplier=Avnet; Supplier Part Number 1: 296-32213-1-ND; Manufacturer Part Number: REF3012AIDBZR
U5 U6 = INA199A1DCKR: IC OPAMP CURR SENSE 14KHZ SC70-6; Manufacturer: Texas Instruments; Amplifier Type: Current Sense; Number of Circuits: 1; Slew Rate: 0.4 V/µs; Current - Input Bias: 28µA; Voltage - Input Offset: 5µV; Current - Supply: 65µA; Voltage - Supply, Single/Dual (±): 2.7 V ~ 26 V; Other Names: 296-27329-6; Supplier 1: Digi-Key; Stock 1: 158615; Pricing 1: 1=0.83, 10=0.738, 25=0.7, 100=0.5375, 250=0.475, 500=0.45, 1000=0.35 (USD); Standard Package: 1; Category: Integrated Circuits (ICs); Family: Linear - Amplifiers - Instrumentation, OP Amps, Buffer Amps; Series: -; Output Type: -; Gain Bandwidth Product: 14kHz; -3db Bandwidth: -; Current - Output / Channel: -; Operating Temperature: -40°C ~ 105°C; Mounting Type: Surface Mount; Package / Case: 6-TSSOP, SC-88, SOT-363; Supplier Device Package: SC-70-6; Packaging: Digi-Reel®; Dynamic Catalog: Current Sense; ComponentLink1URL: http://components.arrow.com/part/dataview/48823731S9057778N7713?src-supplier=Arrow; ComponentLink1Description: http://components.arrow.com/part/dataview/48823731S9057778N7713?src-supplier=Arrow; ComponentLink2URL: https://www.verical.com/server-webapp/html/getDatasheet?partID=518602&src-supplier=Verical; ComponentLink2Description: https://www.verical.com/server-webapp/html/getDatasheet?partID=518602&src-supplier=Verical; ComponentLink3URL: http://components.arrow.com/part/dataview/0323_01815168?src-supplier=Arrow+Europe; ComponentLink3Description: http://components.arrow.com/part/dataview/0323_01815168?src-supplier=Arrow+Europe; ComponentLink4URL: http://www.farnell.com/datasheets/2019159.pdf?src-supplier=Element14; ComponentLink4Description: http://www.farnell.com/datasheets/2019159.pdf?src-supplier=Element14; ComponentLink5URL: http://www.ti.com/general/docs/lit/getliterature.tsp?genericPartNumber=INA199&fileType=pdf&src-supplier=Farnell; ComponentLink5Description: http://www.ti.com/general/docs/lit/getliterature.tsp?genericPartNumber=INA199&fileType=pdf&src-supplier=Farnell; ComponentLink6URL: http://focus.ti.com/lit/ds/symlink/ina199a2.pdf?src-supplier=Avnet+Europe; ComponentLink6Description: http://focus.ti.com/lit/ds/symlink/ina199a2.pdf?src-supplier=Avnet+Europe; ComponentLink7URL: http://www.farnell.com/datasheets/1846955.pdf?src-supplier=Farnell; ComponentLink7Description: http://www.farnell.com/datasheets/1846955.pdf?src-supplier=Farnell; ComponentLink8URL: http://www.ti.com/lit/ds/symlink/ina199.pdf?src-supplier=Digi-Key; ComponentLink8Description: http://www.ti.com/lit/ds/symlink/ina199.pdf?src-supplier=Digi-Key; ComponentLink9URL: http://www.ti.com/lit/gpn/ina199?src-supplier=Mouser; ComponentLink9Description: http://www.ti.com/lit/gpn/ina199?src-supplier=Mouser; ComponentLink10URL: http://www.ti.com/general/docs/lit/getliterature.tsp?genericPartNumber=INA199&&fileType=pdf&src-supplier=Avnet; ComponentLink10Description: http://www.ti.com/general/docs/lit/getliterature.tsp?genericPartNumber=INA199&&fileType=pdf&src-supplier=Avnet; Supplier Part Number 1: 296-27329-1-ND; Manufacturer Part Number: INA199A1DCKR

## Sheet [02] PMIC_POWER.SchDoc
size B; DocumentNumber: 02; SheetNumber: 02; SheetTotal: 3
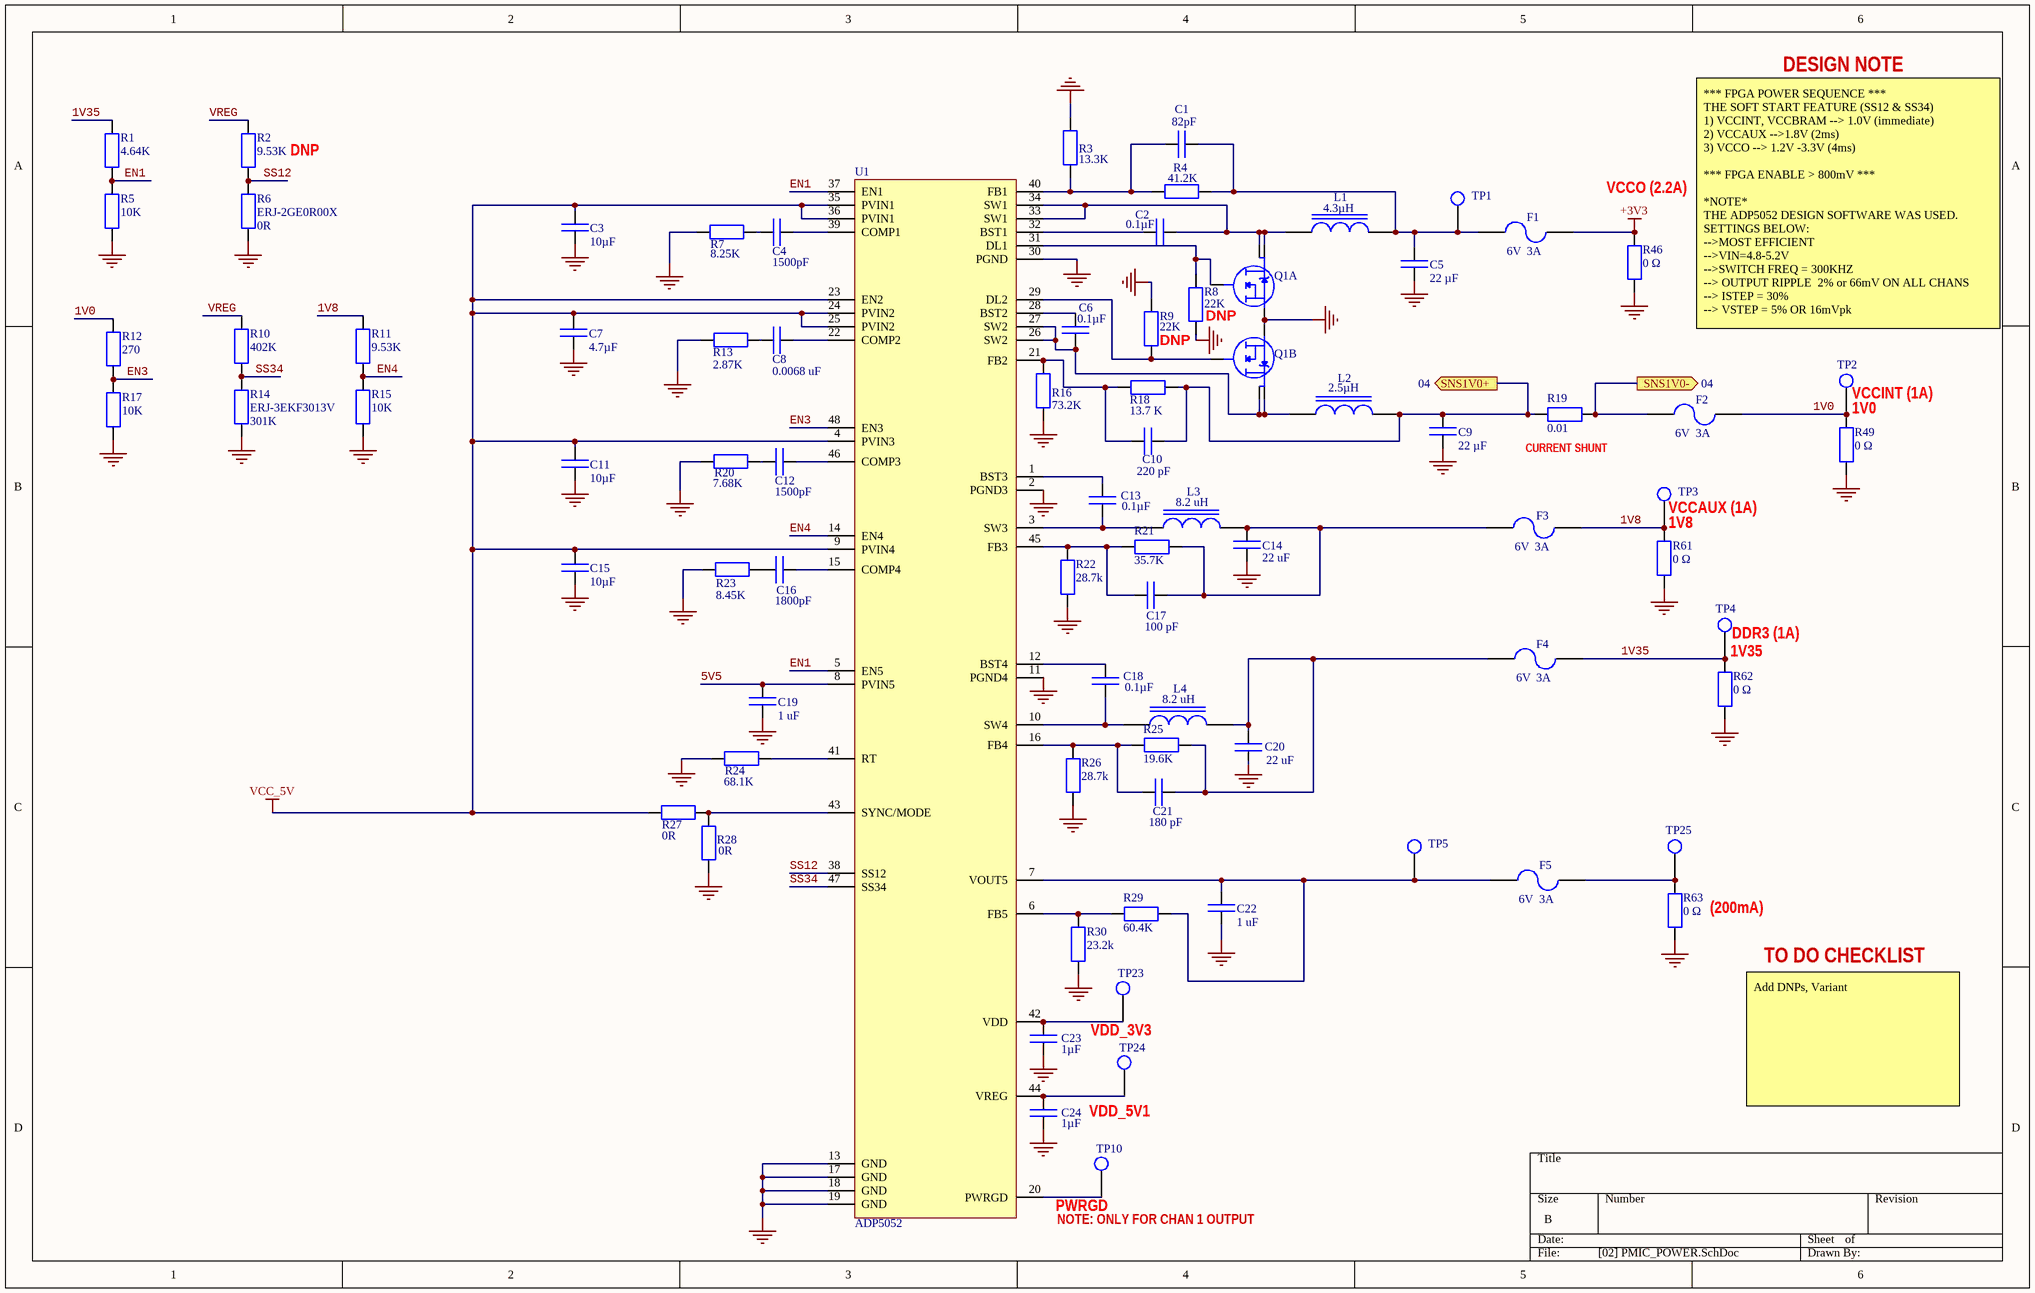
[diagram p2: [02] PMIC_POWER.SchDoc]

### Parts
C1  Capacitance: 82pF  [R0402]  (hidden comment: GCM1555C1H820FA16D)
C2  Capacitance: 0.1µF  [R0402]  (hidden comment: CC0402KRX7R6BB104)
C3  Capacitance: 10µF  [C1206]  (hidden comment: C3216X5R1C106M160AA)
C4  Capacitance: 1500pF  [R0402]  (hidden comment: GCM155R71H152KA37D)
C5  Capacitance: 22 µF  [C1206]  (hidden comment: 12063D226KAT2A)
C6  Capacitance: 0.1µF  [R0402]  (hidden comment: CC0402KRX7R6BB104)
C7  Capacitance: 4.7µF  [C0805_1]  (hidden comment: C2012X5R1C475K060AC)
C8  Capacitance Value: 0.0068 uF  [R0402]  (hidden comment: GCM155R71H682KA55D)
C9  Capacitance: 22 µF  [C1206]  (hidden comment: 12063D226KAT2A)
C10  Capacitance Value: 220 pF  [R0402]  (hidden comment: GCM155R71H221KA37D)
C11  Capacitance: 10µF  [C1206]  (hidden comment: C3216X5R1C106M160AA)
C12  Capacitance: 1500pF  [R0402]  (hidden comment: GCM155R71H152KA37D)
C13  Capacitance: 0.1µF  [R0402]  (hidden comment: CC0402KRX7R6BB104)
C14  Capacitance Value: 22 uF  [C0805_1]  (hidden comment: GRM21BR60J226ME39K)
C15  Capacitance: 10µF  [C1206]  (hidden comment: C3216X5R1C106M160AA)
C16  Capacitance: 1800pF  [C0805_1]  (hidden comment: GRM2165C2A182JA01D)
C17  Capacitance: 100 pF  [R0402]  (hidden comment: C0402C101K4GACTU)
C18  Capacitance: 0.1µF  [R0402]  (hidden comment: CC0402KRX7R6BB104)
C19  Capacitance: 1 uF  [C0603_1]  (hidden comment: C0603C105K8RACTU)
C20  Capacitance Value: 22 uF  [C0805_1]  (hidden comment: GRM21BR60J226ME39K)
C21  Capacitance: 180 pF  [R0402]  (hidden comment: C0402C181K5RACTU)
C22  Capacitance: 1 uF  [C0603_1]  (hidden comment: C0603C105K8RACTU)
C23  Capacitance: 1µF  (hidden comment: CC0402KRX5R5BB105)
C24  Capacitance: 1µF  (hidden comment: CC0402KRX5R5BB105)
F1  Voltage - Max: 6V  Current - Hold (Ih) (Max): 3A  [C1206 - PTC]  (hidden comment: MF-NSML300-2)
F2  Voltage - Max: 6V  Current - Hold (Ih) (Max): 3A  [C1206 - PTC]  (hidden comment: MF-NSML300-2)
F3  Voltage - Max: 6V  Current - Hold (Ih) (Max): 3A  [C1206 - PTC]  (hidden comment: MF-NSML300-2)
F4  Voltage - Max: 6V  Current - Hold (Ih) (Max): 3A  [C1206 - PTC]  (hidden comment: MF-NSML300-2)
F5  Voltage - Max: 6V  Current - Hold (Ih) (Max): 3A  [C1206 - PTC]  (hidden comment: MF-NSML300-2)
L1  Inductance: 4.3µH  [14.3uH_10_2mmX10_2mmX4mm]  (hidden comment: 7443552430)
L2  Inductance: 2.5µH  [2.5UH_10_2MMX10_2MM]  (hidden comment: 7447798250)
L3  Inductance: 8.2 uH  [8.2UH_5.28MMX5.28MM]  (hidden comment: XAL5050-822MEB)
L4  Inductance: 8.2 uH  [8.2UH_5.28MMX5.28MM]  (hidden comment: XAL5050-822MEB)
Q1  IRF8910  [8-SOIC]  (value not drawn)  (parts A,B of 2)
R1  Resistance: 4.64K  [R0603]  (hidden comment: ERJ-3EKF4641V)
R2  Resistance (Ohms): 9.53K  [R0603]  (hidden comment: ERJ-3EKF9531V)
R3  Resistance (Ohms): 13.3K  [R0805]  (hidden comment: CRCW080513K3FKEA)
R4  Resistance: 41.2K  [R0805]  (hidden comment: CRCW080541K2FKEA)
R5  Resistance: 10K  [R0603]  (hidden comment: ERJ-3EKF1002V)
R6  ERJ-2GE0R00X  Resistance (Ohms): 0R  [R0603]
R7  Resistance: 8.25K  [R0805]  (hidden comment: ERJ-6ENF8251V)
R8  Resistance: 22K  [R0402]  (hidden comment: CRCW040222K0FKED)
R9  Resistance: 22K  [R0402]  (hidden comment: CRCW040222K0FKED)
R10  Resistance (Ohms): 402K  [R0603]  (hidden comment: ERJ-3EKF4023V)
R11  Resistance (Ohms): 9.53K  [R0603]  (hidden comment: ERJ-3EKF9531V)
R12  Resistance: 270  [R0603]  (hidden comment: ERJ-3EKF2700V)
R13  Resistance (Ohms): 2.87K  [R0805]  (hidden comment: RC0805FR-072K87L)
R14  ERJ-3EKF3013V  Resistance: 301K  [R0603]
R15  Resistance: 10K  [R0603]  (hidden comment: ERJ-3EKF1002V)
R16  Resistance: 73.2K  [R0402]  (hidden comment: ERJ-2RKF7322X)
R17  Resistance: 10K  [R0603]  (hidden comment: ERJ-3EKF1002V)
R18  Resistance: 13.7 K  [R0402]  (hidden comment: ERJ-2RKF1372X)
R19  Resistance (Ohms): 0.01  [R0603]  (hidden comment: ERJ-3LWFR010V)
R20  Resistance (Ohms): 7.68K  [R0805]  (hidden comment: ERJ-6ENF7681V)
R21  Resistance: 35.7K  [R0402]  (hidden comment: ERJ-2RKF3572X)
R22  Resistance (Ohms): 28.7k  [R0402]  (hidden comment: CRCW040228K7FKED)
R23  Resistance: 8.45K  [R0805]  (hidden comment: ERJ-6ENF8451V)
R24  Resistance: 68.1K  [R0402]  (hidden comment: ERJ-2RKF6812X)
R25  Resistance: 19.6K  [R0402]  (hidden comment: ERJ-2RKF1962X)
R26  Resistance (Ohms): 28.7k  [R0402]  (hidden comment: CRCW040228K7FKED)
R27  Resistance (Ohms): 0R  [R0603]  (hidden comment: ERJ-2GE0R00X)
R28  Resistance (Ohms): 0R  [R0603]  (hidden comment: ERJ-2GE0R00X)
R29  Resistance: 60.4K  [R0402]  (hidden comment: ERJ-2RKF6042X)
R30  Resistance (Ohms): 23.2k  [R0402]  (hidden comment: ERJ-2RKF2322X)
R46  Resistance: 0 Ω  [R0805]  (hidden comment: ERJ-6GEY0R00V)
R49  Resistance: 0 Ω  [R0805]  (hidden comment: ERJ-6GEY0R00V)
R61  Resistance: 0 Ω  [R0805]  (hidden comment: ERJ-6GEY0R00V)
R62  Resistance: 0 Ω  [R0805]  (hidden comment: ERJ-6GEY0R00V)
R63  Resistance: 0 Ω  [R0805]  (hidden comment: ERJ-6GEY0R00V)
TP1  5017  [TEST_POINT]  (value not drawn)
TP2  5017  [TEST_POINT]  (value not drawn)
TP3  5017  [TEST_POINT]  (value not drawn)
TP4  5017  [TEST_POINT]  (value not drawn)
TP5  5017  [TEST_POINT]  (value not drawn)
TP10  5017  [TEST_POINT]  (value not drawn)
TP23  5017  [TEST_POINT]  (value not drawn)
TP24  5017  [TEST_POINT]  (value not drawn)
TP25  5017  [TEST_POINT]  (value not drawn)
U1  ADP5052  [48-LFSCP]

### Ports
SNS1V0+ (out, see 04), SNS1V0- (out, see 04)

### Nets
+3V3: F1.2 R46.1
GND: C3.1 C5.1 C7.1 C9.1 C11.1 C14.1 C15.1 C19.1 C20.1 C22.1 C23.1 C24.1 Q1.1(S1) Q1.3(S2) R3.2 R5.1 R6.1 R7.1 R8.1 R9.2 R13.1 R14.1 R15.1 R16.1 R17.1 R20.1 R22.1 R23.1 R24.1 R26.1 R28.2 R30.1 R46.2 R49.2 R61.2 R62.2 R63.2 U1.2(PGND3) U1.11(PGND4) U1.13(GND) U1.17(GND) U1.18(GND) U1.19(GND) U1.30(PGND)
VCC_5V: C3.2 C7.2 C11.2 C15.2 R27.2 U1.4(PVIN3) U1.9(PVIN4) U1.23(EN2) U1.24(PVIN2) U1.25(PVIN2) U1.35(PVIN1) U1.36(PVIN1)
1V0: F2.2 R12.2 R49.1 TP2.1
1V8: F3.2 R11.2 R61.1 TP3.1
1V35: F4.2 R1.2 R62.1 TP4.1
5V5: C19.2 U1.8(PVIN5)
EN1: R1.1 R5.2 U1.5(EN5) U1.37(EN1)
EN3: R12.1 R17.2 U1.48(EN3)
EN4: R11.1 R15.2 U1.14(EN4)
SS12: R2.1 R6.2 U1.38(SS12)
SS34: R10.1 R14.2 U1.47(SS34)
VREG: R2.2 R10.2
NetC1_1: C1.1 C5.2 F1.1 L1.2 R4.2 TP1.1
NetC1_2: C1.2 R3.1 R4.1 U1.40(FB1)
NetC2_1: C2.1 L1.1 Q1.7(D1) Q1.8(D1) U1.33(SW1) U1.34(SW1)
NetC2_2: C2.2 U1.32(BST1)
NetC4_1: C4.1 U1.39(COMP1)
NetC4_2: C4.2 R7.2
NetC6_1: C6.1 U1.28(BST2)
NetC6_2: C6.2 L2.1 Q1.5(D2) Q1.6(D2) U1.26(SW2) U1.27(SW2)
NetC8_1: C8.1 U1.22(COMP2)
NetC8_2: C8.2 R13.2
NetC9_2: C9.2 C10.1 L2.2 R18.1 R19.1 ; port SNS1V0+
NetC10_2: C10.2 R16.2 R18.2 U1.21(FB2)
NetC12_1: C12.1 U1.46(COMP3)
NetC12_2: C12.2 R20.2
NetC13_1: C13.1 U1.1(BST3)
NetC13_2: C13.2 L3.1 U1.3(SW3)
NetC14_2: C14.2 C17.1 F3.1 L3.2 R21.2
NetC16_1: C16.1 U1.15(COMP4)
NetC16_2: C16.2 R23.2
NetC17_2: C17.2 R21.1 R22.2 U1.45(FB3)
NetC18_1: C18.1 U1.12(BST4)
NetC18_2: C18.2 L4.1 U1.10(SW4)
NetC20_2: C20.2 C21.1 F4.1 L4.2 R25.2
NetC21_2: C21.2 R25.1 R26.2 U1.16(FB4)
NetC22_2: C22.2 F5.1 R29.2 TP5.1 U1.7(VOUT5)
NetC23_2: C23.2 TP23.1 U1.42(VDD)
NetC24_2: C24.2 TP24.1 U1.44(VREG)
NetF2_1: F2.1 R19.2 ; port SNS1V0-
NetF5_2: F5.2 R63.1 TP25.1
NetQ1_2: Q1.2(G1) R8.2 U1.31(DL1)
NetQ1_4: Q1.4(G2) R9.1 U1.29(DL2)
NetR24_2: R24.2 U1.41(RT)
NetR27_1: R27.1 R28.1 U1.43(SYNC/MODE)
NetR29_1: R29.1 R30.2 U1.6(FB5)
NetTP10_1: TP10.1 U1.20(PWRGD)

### Notes on the sheet
- DESIGN NOTE
- VCCO (2.2A)
- (near R9) DNP
- (near Q1) DNP
- *** FPGA POWER SEQUENCE ***
  THE SOFT START FEATURE (SS12 & SS34)
  1) VCCINT, VCCBRAM --> 1.0V (immediate)
  2) VCCAUX -->1.8V (2ms)
  3) VCCO --> 1.2V -3.3V (4ms)
  *** FPGA ENABLE > 800mV ***
  *NOTE*
  THE ADP5052 DESIGN SOFTWARE WAS USED. SETTINGS BELOW:
  -->MOST EFFICIENT
  -->VIN=4.8-5.2V
  -->SWITCH FREQ = 300KHZ
  --> OUTPUT RIPPLE  2% or 66mV ON ALL CHANS
  --> ISTEP = 30%
  --> VSTEP = 5% OR 16mVpk
- (near TP2) VCCINT (1A)
- 1V0
- (near R19) CURRENT SHUNT
- (near TP3) VCCAUX (1A)
- 1V8
- (near TP4) DDR3 (1A)
- 1V35
- (near R63) (200mA)
- TO DO CHECKLIST
- VDD_3V3
- Add DNPs, Variant
- VDD_5V1
- PWRGD
- NOTE: ONLY FOR CHAN 1 OUTPUT